# EAGLE design AHE (EAGLE 7.6.0)
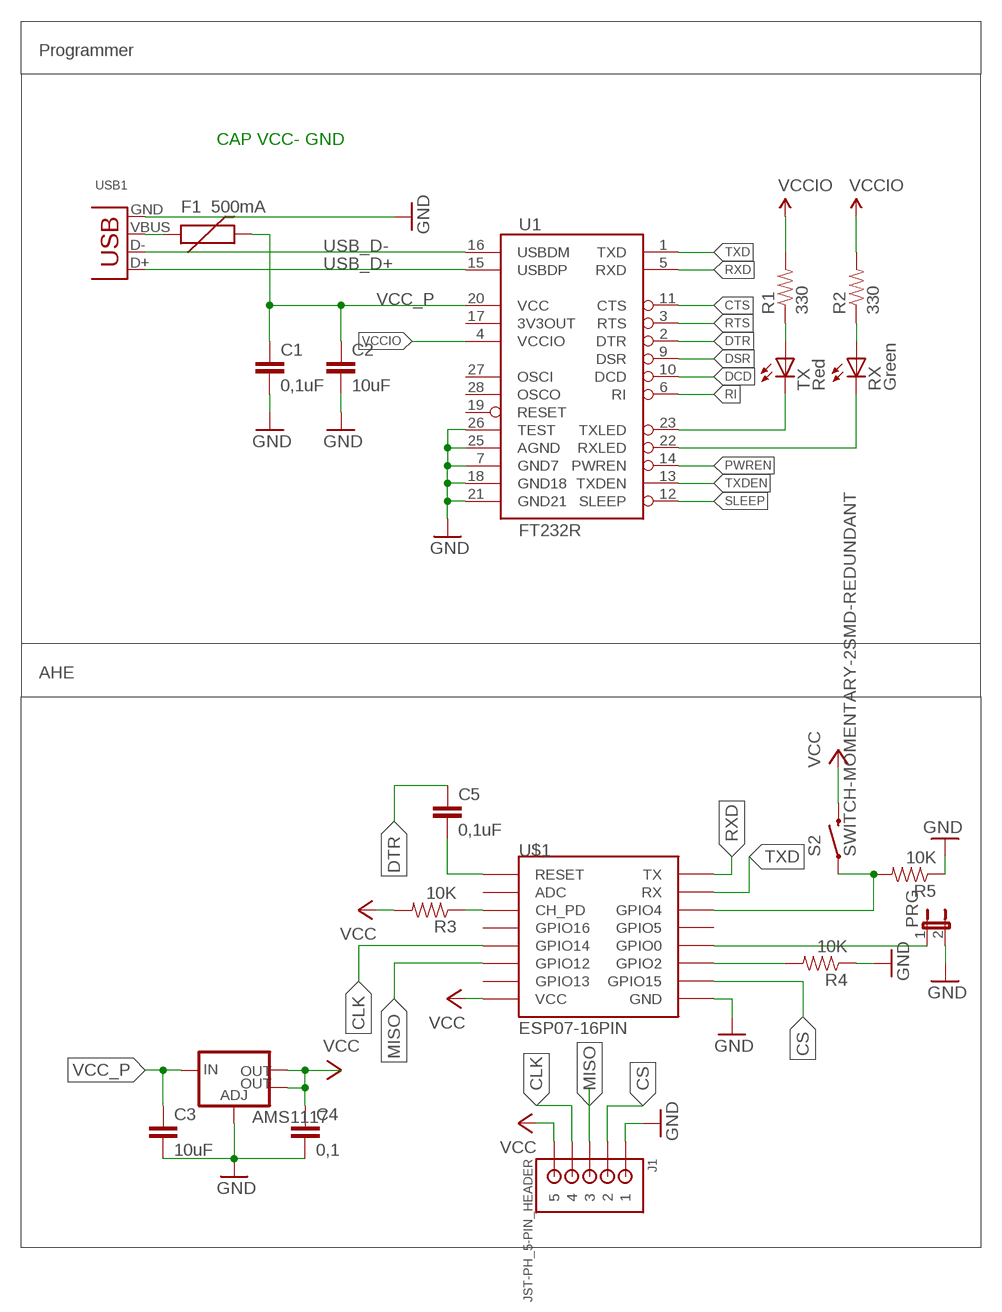
[diagram p0: schematic, sheet 1]

## Parts
AMS1117  V_REG_LM1117SOT223  [SOT223]
C1  0,1uF  10UF10V10%(0805)  [0805-CAP]
C2  10uF  10UF10V10%(0805)  [0805-CAP]
C3  10uF  10UF10V10%(0805)  [0805-CAP]
C4  0,1  10UF10V10%(0805)  [0805-CAP]
C5  0,1uF  10UF10V10%(0805)  [0805-CAP]
F1  500mA  PTCSMD  [PTC-1206]
J1  JST-PH_5-PIN_HEADER  [JST_B5B-PH_HEADER]
PRG  JP1E  [JP1]
R1  330  0.22OHM-1/4W-1%(0805)  [0805]
R2  330  0.22OHM-1/4W-1%(0805)  [0805]
R3  10K  0.22OHM-1/4W-1%(0805)  [0805]
R4  10K  0.22OHM-1/4W-1%(0805)  [0805]
R5  10K  0.22OHM-1/4W-1%(0805)  [0805]
RX  Green  LEDSML0805  [SML0805]
S2  SWITCH-MOMENTARY-2SMD-REDUNDANT  [TACTILE-SWITCH-SMD]
TX  Red  LEDSML0805  [SML0805]
U1  FT232R  FT232RLSSOP  [SSOP28DB]
U$1  ESP07-16PIN  [ESP07-16PIN]
USB1  USB-MB-S  [USB-MB-S]

## Nets
CLK: J1.P4 U$1.GPIO14
CS: J1.P2 U$1.GPIO15
CTS: U1.11(CTS)
DCD: U1.10(DCD)
DSR: U1.9(DSR)
DTR: C5.1 U1.2(DTR)
GND [power]: AMS1117.1(ADJ) C1.2 C2.2 C3.2 C4.2 J1.P1 PRG.2 R4.1 R5.1 U1.7(GND7) U1.18(GND18) U1.21(GND21) U1.25(AGND) U1.26(TEST) U$1.GND USB1.GND
MISO: J1.P3 U$1.GPIO12
N$1: R1.1 TX.A
N$2: R2.1 RX.A
N$3: F1.1 USB1.VBUS
N$4: R3.1 U$1.CH_PD
N$5: C5.2 U$1.REST(RESET)
N$6: R4.2 U$1.GPIO2
N$7: PRG.1 U$1.GPIO0
N$16: R5.2 S2.1 S2.2 U$1.GPIO4
PWREN: U1.14(PWREN)
RI: U1.6(RI)
RTS: U1.3(RTS)
RXD: U1.5(RXD) U$1.TX
RXLED: RX.C U1.22(RXLED)
SLEEP: U1.12(SLEEP)
TXD: U1.1(TXD) U$1.RX
TXDEN: U1.13(TXDEN)
TXLED: TX.C U1.23(TXLED)
USB_D+: U1.15(USBDP) USB1.D+
USB_D-: U1.16(USBDM) USB1.D-
VCC [power]: AMS1117.2(OUT) AMS1117.4(OUT) C4.1 J1.P5 R3.2 S2.3 S2.4 U$1.VCC
VCC_P [power]: AMS1117.3(IN) C1.1 C2.1 C3.1 F1.2 U1.20(VCC)
VCCIO: R1.2 R2.2 U1.4(VCCIO)
Unconnected: U1.17(3V3OUT) U1.19(RESET) U1.27(OSCI) U1.28(OSCO) U$1.ADC U$1.GPIO5 U$1.GPIO13 U$1.GPIO16

## Notes on the sheet
- Programmer
- CAP VCC- GND
- AHE

## Library data of the parts
AMS1117 = SparkFun-PowerIC:V_REG_LM1117: Voltage Regulator LM1117 Standard adjustable voltage regulator but in SMD form. Spark Fun Electronics SKU : COM-00595; PROD_ID: VREG-08170
C1-C5 = SparkFun-Capacitors:10UF10V10%(0805): CAP-11330; PROD_ID: CAP-11330
F1 = SparkFun:PTC: Resettable Fuse PTC Resettable Fuse. Spark Fun Electronics SKU : COM-08357
J1 = SRG:JST-PH_5-PIN_HEADER: 5-pin JST PH Shrouded Header, top entry P/N B5B-PH-K-S Mating connector PHR-5 Mating cable assembly: Sparkfun PRT-09917 <http://www.sparkfun.com/products/9917>
PRG = jumper:JP1E: JUMPER
R1-R5 = SparkFun-Resistors:0.22OHM-1/4W-1%(0805): RES-09883; PROD_ID: RES-09883; VALUE: 0.22
RX TX = led:LED: LED OSRAM: - CHIPLED LG R971, LG N971, LY N971, LG Q971, LY Q971, LO R971, LY R971 LH N974, LH R974 LS Q976, LO Q976, LY Q976 LO Q996 - Hyper CHIPLED LW Q18S LB Q993, LB Q99A, LB R99A - SideLED LS A670, LO A670, LY A670, LG A670, LP A670 LB A673, LV A673, LT A673, LW A673 LH A674 LY A675 LS A676, LA A676, LO A676, LY A676, LW A676 LS A679, LY A679, LG A679 - Hyper Micro SIDELED® LS Y876, LA Y876, LO Y876, LY Y876 LT Y87S - SmartLED LW L88C, LW L88S LB L89C, LB L89S, LG L890 LS L89K, LO L89K, LY L89K LS L896, LA L896, LO L896, LY L896 - TOPLED LS T670, LO T670, LY T670, LG T670, LP T670 LSG T670, LSP T670, LSY T670, LOP T670, LYG T670 LG T671, LOG T671, LSG T671 LB T673, LV T673, LT T673, LW T673 LH T674 LS T676, LA T676, LO T676, LY T676, LB T676, LH T676, LSB T676, LW T676 LB T67C, LV T67C, LT T67C, LS T67K, LO T67K, LY T67K, LW E67C LS E67B, LA E67B, LO E67B, LY E67B, LB E67C, LV E67C, LT E67C LW T67C LS T679, LY T679, LG T679 LS T770, LO T770, LY T770, LG T770, LP T770 LB T773, LV T773, LT T773, LW T773 LH T774 LS E675, LA E675, LY E675, LS T675 LS T776, LA T776, LO T776, LY T776, LB T776 LHGB T686 LT T68C, LB T68C - Hyper Mini TOPLED® LB M676 - Mini TOPLED Santana® LG M470 LS M47K, LO M47K, LY M47K Source: http://www.osram.convergy.de LUXEON: - LUMILED® LXK2-PW12-R00, LXK2-PW12-S00, LXK2-PW14-U00, LXK2-PW14-V00 LXK2-PM12-R00, LXK2-PM12-S00, LXK2-PM14-U00 LXK2-PE12-Q00, LXK2-PE12-R00, LXK2-PE12-S00, LXK2-PE14-T00, LXK2-PE14-U00 LXK2-PB12-K00, LXK2-PB12-L00, LXK2-PB12-M00, LXK2-PB14-N00, LXK2-PB14-P00, LXK2-PB14-Q00 LXK2-PR12-L00, LXK2-PR12-M00, LXK2-PR14-Q00, LXK2-PR14-R00 LXK2-PD12-Q00, LXK2-PD12-R00, LXK2-PD12-S00 LXK2-PH12-R00, LXK2-PH12-S00 LXK2-PL12-P00, LXK2-PL12-Q00, LXK2-PL12-R00 Source: www.luxeon.com KINGBRIGHT: KA-3528ASYC Source: www.kingbright.com
S2 = SparkFun-Electromechanical:SWITCH-MOMENTARY-2: Various NO switches- pushbuttons, reed, etc; PROD_ID: SWCH-08247
U1 = SparkFun:FT232RL: USB UART FT232RL 4th Generation USB UART (USB <-> Serial) Controller. Spark Fun Electronics SKU : COM-00650
U$1 = esp8266modules:ESP07-16PIN: ESP8266 Wifi module 07 - 16 pins; DIMENSIONS: 22.0 x 16.0 mm; PINS: 16; PITCH: 0.078" / 2 mm
USB1 = con-usb-3:USB: USB Connectors

## Net classes
1 power: width 0.254 mm

## Board
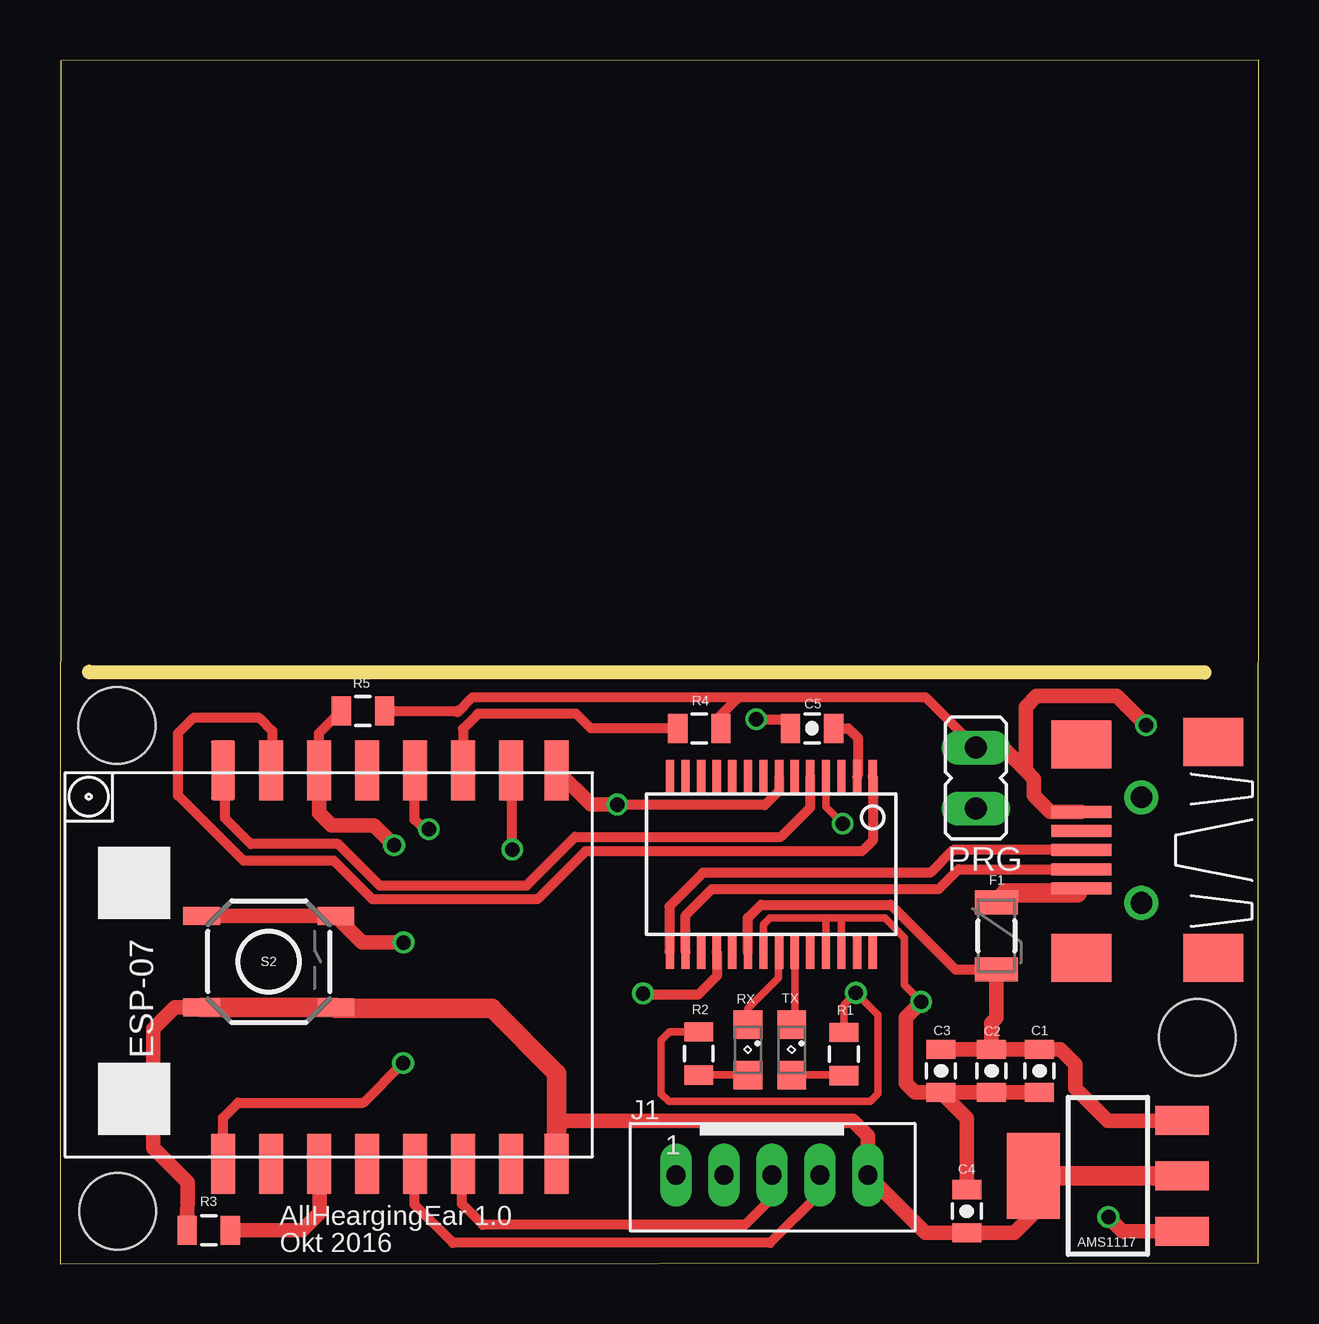
[diagram p1: board, top side]
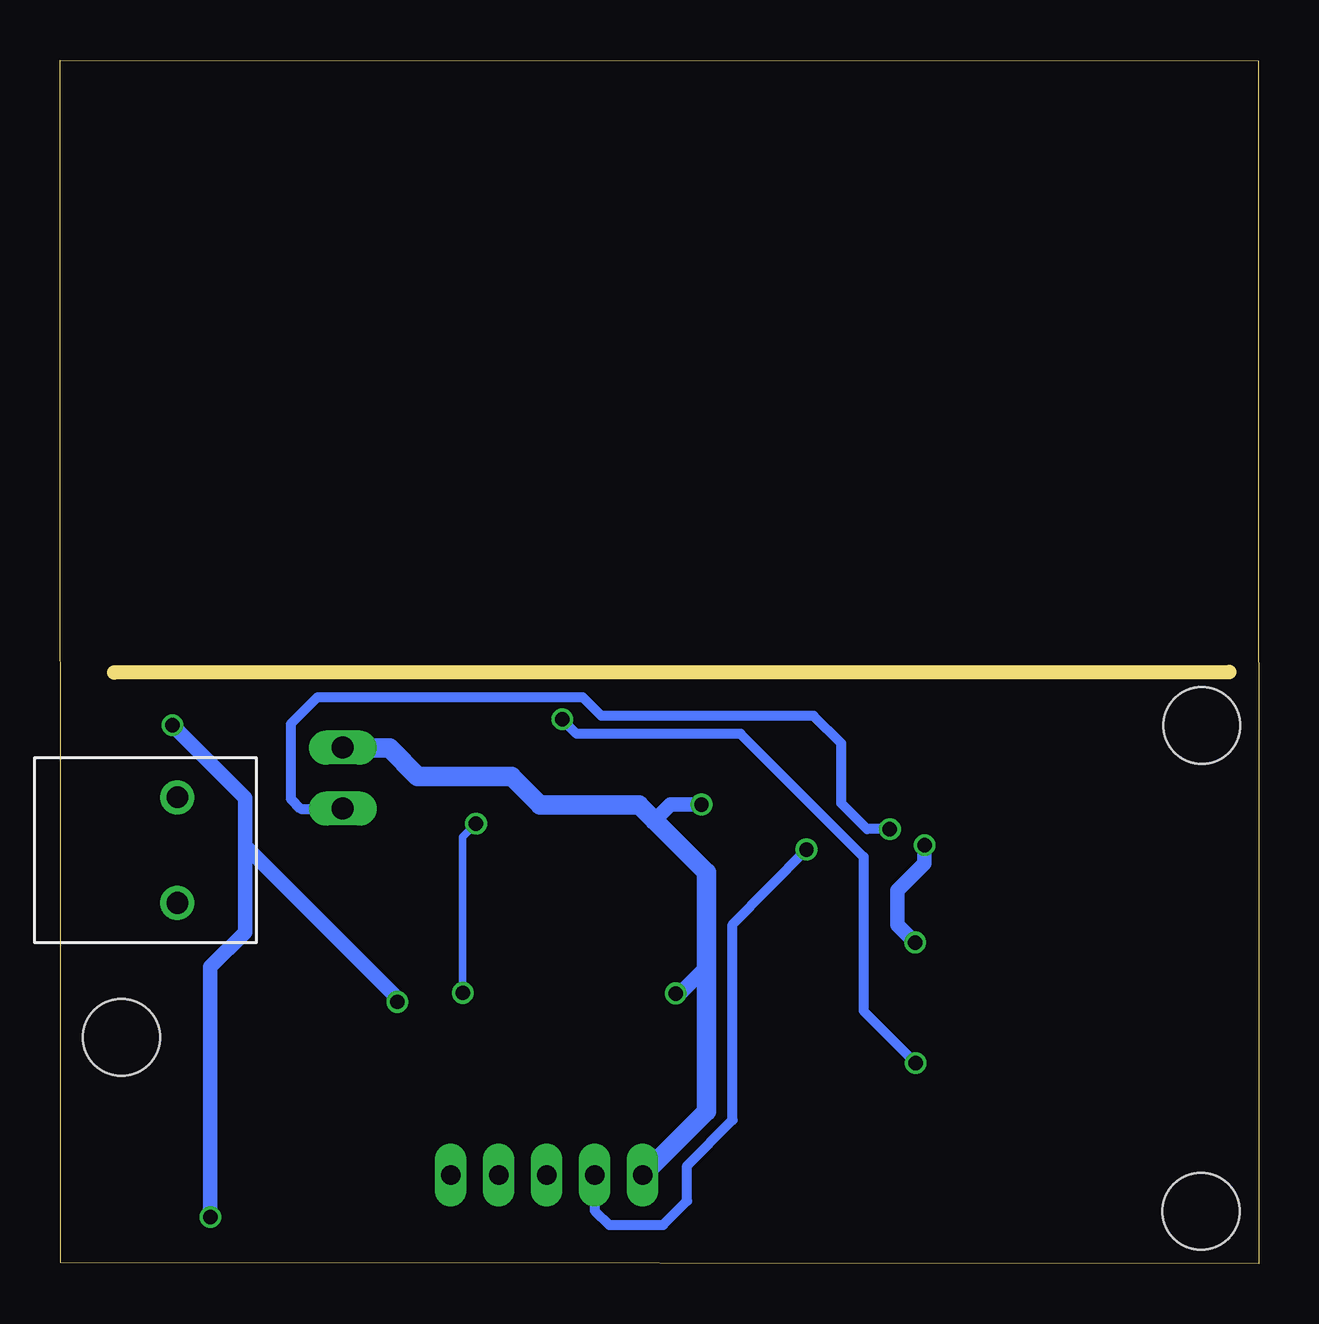
[diagram p2: board, bottom side, seen from below]

Size 49.96 x 50.17 mm. Coordinates in mm from the lower left corner, seen from the top.
Outline: 0,0 49.94,0.02 49.96,50.17 0.02,50.14 0,0
Copper layers (1*16): Top 0.035mm / dielectric 1.5mm / Bottom 0.035mm
Design rules "ITead_rule": minimum track width 6mil, minimum drill 12mil, track to track 6mil, track to pad 6mil, pad to pad 6mil, via to via 6mil, smd to smd 0mil, copper to edge 10mil, drill to drill 10mil, minimum pad ring 10mil, minimum via ring 6mil, stop-mask expansion 2mil, vias tented up to drill 100mil, thermal gap 10mil
Holes 3.2 mm at 47.4,9.43 2.4,2.18 2.38,22.43
Milling: 1 lines

### Footprints (pad centres in the part's own frame; a part is rotated, then mirrored left to right if it is on the bottom)
SOT223 = smd 1.219 x 2.235: 1 -2.311,-3.099; 2 0,-3.099; 3 2.311,-3.099 | smd 3.6 x 2.2: 4 0,3.099
0805-CAP = smd 0.8 x 1.2: 1 -0.9,0; 2 0.9,0
PTC-1206 = smd 1 x 1.8: 1 -1.4,0; 2 1.4,0
JST_B5B-PH_HEADER = drill 0.8 long: P1 4,0.048; P2 2,0.048; P3 0,0.048; P4 -2,0.048; P5 -4,0.048
JP1 = drill 0.914 long: 1 0,-1.27; 2 0,1.27
0805 = smd 0.8 x 1.2: 1 -0.9,0; 2 0.9,0
SML0805 = smd 1.2 x 1.2: A 1.05,0; C -1.05,0
TACTILE-SWITCH-SMD = smd 1.524 x 0.762: 1 -2.794,1.905; 2 2.794,1.905; 3 -2.794,-1.905; 4 2.794,-1.905
SSOP28DB = smd 0.348 x 1.397: 1 -4.225,-3.656; 2 -3.575,-3.656; 3 -2.925,-3.656; 4 -2.275,-3.656; 5 -1.625,-3.656; 6 -0.975,-3.656; 7 -0.325,-3.656; 8 0.325,-3.656; 9 0.975,-3.656; 10 1.625,-3.656; 11 2.275,-3.656; 12 2.925,-3.656; 13 3.575,-3.656; 14 4.225,-3.656; 15 4.225,3.656; 16 3.575,3.656; 17 2.925,3.656; 18 2.275,3.656; 19 1.625,3.656; 20 0.975,3.656; 21 0.325,3.656; 22 -0.325,3.656; 23 -0.975,3.656; 24 -1.625,3.656; 25 -2.275,3.656; 26 -2.925,3.656; 27 -3.575,3.656; 28 -4.225,3.656
ESP07-16PIN = smd 2.5 x 1: ADC -8.2,3.8; CH_PD -8.2,1.8; GND 8.2,-8.105; GPIO0 8.2,-2.2; GPIO2 8.2,-4.2; GPIO4 8.2,1.8; GPIO5 8.2,-0.2; GPIO12 -8.2,-4.2; GPIO13 -8.2,-6.2; GPIO14 -8.2,-2.2; GPIO15 8.2,-6.2; GPIO16 -8.2,-0.2; REST -8.2,5.8; RX 8.2,3.8; TX 8.2,5.8; VCC -8.2,-8.105
USB-MB-S = smd 2.5 x 0.5: D+ 2.5,0; D- 2.5,0.8; GND 2.5,-1.6; ID 2.5,-0.8; VBUS 2.5,1.6 | smd 2.5 x 2: P$1 -3,-4.5; P$2 -3,4.5; P$3 2.5,-4.4; P$4 2.5,4.5 | drill 0.9: P$5 0,2.2; P$6 0,-2.2

### Placement (x,y rotation side)
AMS1117  43.67,3.66 90 top
C1  40.82,8.04 270 top
C2  38.82,8.04 270 top
C3  36.72,8.04 270 top
C4  37.8,2.18 90 top
C5  31.35,22.31 180 top
F1  39.03,13.66 270 top
J1  29.68,3.73 180 top
PRG  38.17,20.24 0 top
R1  32.67,8.74 90 top
R2  26.62,8.76 90 top
R3  6.2,1.39 180 top
R4  26.65,22.31 180 top
R5  12.62,23.04 180 top
RX  28.68,8.91 270 top
S2  8.7,12.58 0 top
TX  30.5,8.91 270 top
U1  29.65,16.64 180 top
U$1  12.6,12.36 90 top
USB1  45.07,17.24 180 top

### Tracks (layer width: path | path; a pad name or v marks a point on that pad's centre or on a via)
CLK
  Top 0.406: J1.P4 31.68,2.93 29.6,0.86 16.38,0.86 14.78,2.46 14.78,4.14 U$1.GPIO14 14.78,5.21
CS  (via drill 0.6)
  Top 0.406: v18.85,17.26 18.82,21.61 U$1.GPIO15
  Bottom 0.406: J1.P2 27.68,2.21 27.07,1.61 24.82,1.61 23.82,2.61 23.82,4.08 21.93,5.99 21.93,14.14 v18.85,17.26
DTR
  Top 0.406: C5.1 32.85,22.31 33.25,21.91 33.25,20.33 U1.2
GND  (via drill 0.6)
  Top 0.305: U1.26 32.57,14.33 32.65,14.41 | 31.88,14.41 29.6,14.41 29.32,14.14 U1.21 | 31.88,14.41 32.65,14.41 | 32.65,14.41 34.38,14.41 35.2,13.58 35.2,11.61 v35.9,10.91 | U1.25 31.93,14.36 31.88,14.41
  Top 0.406: 28.3,23.61 17.2,23.61 16.56,22.97 16.56,23.04 R5.1 | 28.3,23.61 36.07,23.61 PRG.2 | R4.1 27.55,22.86 28.3,23.61 | U1.7 29.98,19.71 29.38,19.11 23.25,19.11 v23.23,19.14 | v24.3,11.26 24.35,11.21 26.6,11.21 27.38,11.99 U1.18
  Top 0.61: AMS1117.1 44.29,1.35 v43.7,1.93 | C1.2 C2.2 C3.2 | C4.2 37.8,6.06 C3.2 | C3.2 35.62,7.14 35.25,7.51 35.25,10.26 v35.9,10.91 | U$1.GND 22.13,19.14 v23.23,19.14 | v45.27,22.43 44.05,23.66 40.7,23.66 40.25,23.21 40.25,20.56 | 38.54,21.5 PRG.2 38.24,21.43 39.38,21.43 40.25,20.56 | USB1.GND 41.27,18.83 40.6,19.51 40.6,20.21 40.25,20.56
  Bottom 0.61: v24.3,11.26 24.12,11.26 23.03,12.36 | v43.7,1.93 43.7,12.36 42.25,13.81 42.25,17.41 | 42.25,17.41 42.25,19.41 v45.27,22.43 | v23.23,19.14 24.53,19.14 25.19,18.47 | v35.9,10.91 35.9,11.06 42.25,17.41
  Bottom 0.813: J1.P1 23.03,6.34 23.03,12.36 23.03,16.31 25.19,18.47 25.82,19.11 29.95,19.11 31.15,20.31 35.05,20.31 36.22,21.49 38.15,21.49 PRG.2
MISO
  Top 0.406: J1.P3 29.68,2.73 28.55,1.61 17.62,1.61 16.75,2.48 16.75,4.11 U$1.GPIO12 16.7,5.14
N$1
  Top 0.305: TX.A 32.65,7.86 R1.1
N$2
  Top 0.305: R2.1 RX.A
N$3
  Top 0.406: 42.4,15.46 arc90 USB1.VBUS
  Top 0.813: F1.1 39.43,15.46 42.4,15.46
N$4
  Top 0.61: R3.1 10.1,1.39 10.83,2.11 10.83,4.14 U$1.CH_PD
N$5  (via drill 0.6)
  Top 0.406: U$1.REST 6.8,6.08 7.42,6.71 12.65,6.71 v14.3,8.36 | v29.03,22.68 30.07,22.68 C5.2
  Bottom 0.406: v14.3,8.36 16.48,10.54 16.48,16.96 21.6,22.08 28.43,22.08 v29.03,22.68
N$6
  Top 0.406: R4.2 22.12,22.31 21.53,22.91 17.43,22.91 16.8,22.29 U$1.GPIO2
N$7  (via drill 0.6)
  Top 0.406: v15.38,18.11 15.18,18.11 14.78,18.51 14.78,20.54 U$1.GPIO0
  Bottom 0.406: PRG.1 39.92,18.96 40.35,19.39 40.35,22.49 39.22,23.61 28.18,23.61 27.4,22.83 18.55,22.83 17.4,21.68 17.4,19.18 16.32,18.11 v15.38,18.11
N$16  (via drill 0.6)
  Top 0.406: U$1.GPIO4 10.8,22.11 R5.2
  Top 0.61: v13.93,17.43 13.1,18.26 11.33,18.26 10.8,18.79 U$1.GPIO4 | 11.51,14.51 S2.1 S2.2 12.6,13.39 v14.33,13.39
  Bottom 0.61: v13.93,17.43 13.93,16.68 15.05,15.56 15.05,14.11 v14.33,13.39
RXD
  Top 0.406: U1.5 31.28,19.01 30.05,17.79 21.48,17.79 19.45,15.76 13.33,15.76 11.6,17.49 7.95,17.49 6.88,18.56 6.88,20.49 U$1.TX
RXLED
  Top 0.305: 29.95,12.81 29.98,12.83 U1.22 29.95,12.96 29.95,11.91 28.68,10.64 RX.C
TXD
  Top 0.406: U1.1 33.88,17.64 33.42,17.18 21.9,17.18 19.9,15.18 13.03,15.18 11.43,16.79 7.65,16.79 4.92,19.51 4.92,22.11 5.58,22.76 8.3,22.76 8.85,22.21 8.85,20.61 U$1.RX 8.83,21.66
TXLED
  Top 0.305: U1.23 30.62,10.08 TX.C
USB_D+
  Top 0.406: USB1.D+ 37.22,17.24 36.27,16.29 26.8,16.29 25.4,14.89 25.4,13.01 U1.15
USB_D-
  Top 0.406: U1.16 26.07,14.51 27.18,15.61 36.62,15.61 37.45,16.43 USB1.D-
VCC
  Top 0.61: R3.2 5.33,3.39 3.88,4.83 3.88,9.79 4.77,10.68 S2.3 5.5,10.68 | AMS1117.4 40.65,4.34 40.65,2.16 39.77,1.29 C4.1 36.08,1.29 J1.P5 33.67,5.33 33.05,5.96 21.03,5.96 20.7,5.64 U$1.VCC
  Top 0.813: AMS1117.4 AMS1117.2 | U$1.VCC 20.71,7.93 18,10.64 11.49,10.64 S2.4 S2.3
VCC_P
  Top 0.406: U1.20 28.68,14.41 29.23,14.96 34.62,14.96 37.32,12.26 F1.2
  Top 0.61: C3.1 C2.1 | C2.1 C1.1 41.7,8.93 42.32,8.31 42.32,7.31 43.67,5.96 AMS1117.3 | F1.2 39.03,10.24 38.82,10.04 C2.1
VCCIO  (via drill 0.6)
  Top 0.305: v32.62,18.33 31.93,19.04 U1.4 | R2.2 25.4,9.66 25.05,9.31 25.05,7.08 25.38,6.76 33.77,6.76 34.1,7.08 34.1,10.36 v33.17,11.29 32.67,10.79 R1.2
  Bottom 0.305: v33.17,11.29 33.17,17.79 v32.62,18.33

### Text on the board
tPlace: AllHeargingEar 1.0 | Okt 2016